# Altium project Draft1.PrjPcb
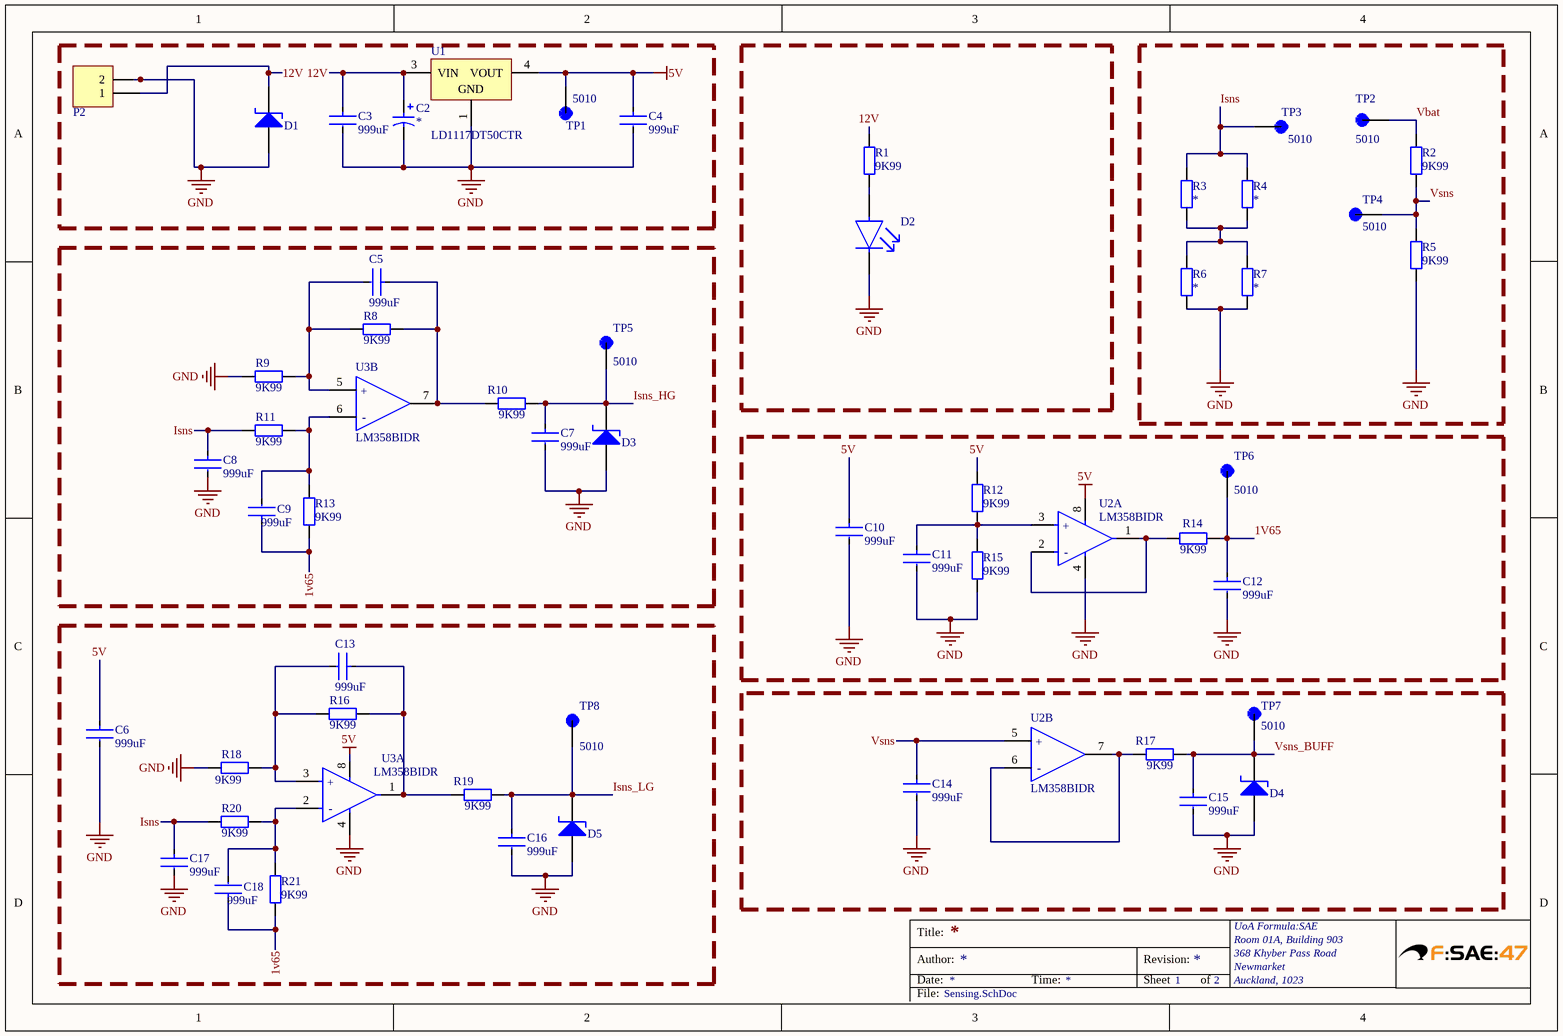
[diagram p0: Sensing.SchDoc]
2 sheets, 65 parts. Net scope: global (net labels, ports and power ports of the same name join across sheets).
Board file: Draft1.PcbDoc
Sheets:
  Sensing.SchDoc
  ESP32.SchDoc

## Sheet Sensing.SchDoc
size A4; Organization: UoA Formula:SAE; Address1: Room 01A, Building 903; Address2: 368 Khyber Pass Road; Address3: Newmarket; Address4: Auckland, 1023; SheetNumber: 1; SheetTotal: 2

### Parts
C2  *  [CAP-RAD-2.5mm Pitch]
C3  Capacitance: 999uF  [FP-CL21-IPC_A]  (hidden comment: CL21B104KBCNNNC)
C4  Capacitance: 999uF  [FP-CL21-IPC_A]  (hidden comment: CL21B104KBCNNNC)
C5  Capacitance: 999uF  [FP-CL21-IPC_A]  (hidden comment: CL21B104KBCNNNC)
C6  Capacitance: 999uF  [FP-CL21-IPC_A]  (hidden comment: CL21B104KBCNNNC)
C7  Capacitance: 999uF  [FP-CL21-IPC_A]  (hidden comment: CL21B104KBCNNNC)
C8  Capacitance: 999uF  [FP-CL21-IPC_A]  (hidden comment: CL21B104KBCNNNC)
C9  Capacitance: 999uF  [FP-CL21-IPC_A]  (hidden comment: CL21B104KBCNNNC)
C10  Capacitance: 999uF  [FP-CL21-IPC_A]  (hidden comment: CL21B104KBCNNNC)
C11  Capacitance: 999uF  [FP-CL21-IPC_A]  (hidden comment: CL21B104KBCNNNC)
C12  Capacitance: 999uF  [FP-CL21-IPC_A]  (hidden comment: CL21B104KBCNNNC)
C13  Capacitance: 999uF  [FP-CL21-IPC_A]  (hidden comment: CL21B104KBCNNNC)
C14  Capacitance: 999uF  [FP-CL21-IPC_A]  (hidden comment: CL21B104KBCNNNC)
C15  Capacitance: 999uF  [FP-CL21-IPC_A]  (hidden comment: CL21B104KBCNNNC)
C16  Capacitance: 999uF  [FP-CL21-IPC_A]  (hidden comment: CL21B104KBCNNNC)
C17  Capacitance: 999uF  [FP-CL21-IPC_A]  (hidden comment: CL21B104KBCNNNC)
C18  Capacitance: 999uF  [FP-CL21-IPC_A]  (hidden comment: CL21B104KBCNNNC)
D1  BZT52H-B4V7  [SOD123]  (value not drawn)
D2  LTST-C170GKT  [FP-LTST-C170GKT-MFG]  (value not drawn)
D3  BZT52H-B4V7  [SOD123]  (value not drawn)
D4  BZT52H-B4V7  [SOD123]  (value not drawn)
D5  BZT52H-B4V7  [SOD123]  (value not drawn)
P2  Connector2way  [ece-TER-2.02]  (value not drawn)
R1  Resistance: 9K99  [RESC2013X60X35ML10T20]  (hidden comment: RC0805FR-071KL)
R2  Resistance: 9K99  [RESC2013X60X35ML10T20]  (hidden comment: RC0805FR-071KL)
R3  D1MPAB2512QR002FA-T4  [2512 Res]  (value not drawn)
R4  D1MPAB2512QR002FA-T4  [2512 Res]  (value not drawn)
R5  Resistance: 9K99  [RESC2013X60X35ML10T20]  (hidden comment: RC0805FR-071KL)
R6  D1MPAB2512QR002FA-T4  [2512 Res]  (value not drawn)
R7  D1MPAB2512QR002FA-T4  [2512 Res]  (value not drawn)
R8  Resistance: 9K99  [RESC2013X60X35ML10T20]  (hidden comment: RC0805FR-071KL)
R9  Resistance: 9K99  [RESC2013X60X35ML10T20]  (hidden comment: RC0805FR-071KL)
R10  Resistance: 9K99  [RESC2013X60X35ML10T20]  (hidden comment: RC0805FR-071KL)
R11  Resistance: 9K99  [RESC2013X60X35ML10T20]  (hidden comment: RC0805FR-071KL)
R12  Resistance: 9K99  [RESC2013X60X35ML10T20]  (hidden comment: RC0805FR-071KL)
R13  Resistance: 9K99  [RESC2013X60X35ML10T20]  (hidden comment: RC0805FR-071KL)
R14  Resistance: 9K99  [RESC2013X60X35ML10T20]  (hidden comment: RC0805FR-071KL)
R15  Resistance: 9K99  [RESC2013X60X35ML10T20]  (hidden comment: RC0805FR-071KL)
R16  Resistance: 9K99  [RESC2013X60X35ML10T20]  (hidden comment: RC0805FR-071KL)
R17  Resistance: 9K99  [RESC2013X60X35ML10T20]  (hidden comment: RC0805FR-071KL)
R18  Resistance: 9K99  [RESC2013X60X35ML10T20]  (hidden comment: RC0805FR-071KL)
R19  Resistance: 9K99  [RESC2013X60X35ML10T20]  (hidden comment: RC0805FR-071KL)
R20  Resistance: 9K99  [RESC2013X60X35ML10T20]  (hidden comment: RC0805FR-071KL)
R21  Resistance: 9K99  [RESC2013X60X35ML10T20]  (hidden comment: RC0805FR-071KL)
TP1  5010  [TP_5010]
TP2  5010  [TP_5010]
TP3  5010  [TP_5010]
TP4  5010  [TP_5010]
TP5  5010  [TP_5010]
TP6  5010  [TP_5010]
TP7  5010  [TP_5010]
TP8  5010  [TP_5010]
U1  LD1117DT50CTR  [TO-252_M]
U2  LM358BIDR  [FP-D0008A-IPC_A]  (parts A,B of 2)
U3  LM358BIDR  [FP-D0008A-IPC_A]  (parts A,B of 2)

### Nets
5V: C4.1 C6.1 C10.1 R12.2 TP1.TP U1.4(VOUT) U2.8(V+) U3.8(V+)
GND: C2.2 C3.2 C4.2 C6.2 C7.2 C8.2 C10.2 C11.2 C12.2 C14.2 C15.2 C16.2 C17.2 D1.1(A) D2.1(C) D3.1(A) D4.1(A) D5.1(A) P2.2 R5.1 R6.1 R7.1 R9.1 R15.1 R18.1 U1.1(GND) U2.4(V-) U3.4(V-)
1V65: C9.1 C12.1 C18.1 R13.1 R14.2 R21.1 TP6.TP
12V: C2.1 C3.1 D1.2(K) P2.1 R1.2 U1.3(VIN)
Isns: C8.1 C17.1 R3.2 R4.2 R11.1 R20.1 TP3.TP
Isns_HG: C7.1 D3.2(K) R10.2 TP5.TP
Isns_LG: C16.1 D5.2(K) R19.2 TP8.TP
Vbat: R2.2 TP2.TP
Vsns: C14.1 R2.1 R5.2 TP4.TP U2.5(IN2+)
Vsns_BUFF: C15.1 D4.2(K) R17.2 TP7.TP
NetC5_1: C5.1 R8.2 R10.1 U3.7(OUT2)
NetC5_2: C5.2 R8.1 R9.2 U3.5(IN2+)
NetC9_2: C9.2 R11.2 R13.2 U3.6(IN2-)
NetC11_1: C11.1 R12.1 R15.2 U2.3(IN1+)
NetC13_1: C13.1 R16.2 R19.1 U3.1(OUT1)
NetC13_2: C13.2 R16.1 R18.2 U3.3(IN1+)
NetC18_2: C18.2 R20.2 R21.2 U3.2(IN1-)
NetD2_2: D2.2(A) R1.1
NetR3_1: R3.1 R4.1 R6.2 R7.2
NetR14_1: R14.1 U2.1(OUT1) U2.2(IN1-)
NetR17_1: R17.1 U2.6(IN2-) U2.7(OUT2)

### Notes on the sheet
- Title:
- Author:
- Date:
- Time:
- Revision:
- Sheet
- of
- File:
- (in symbol CMP-04895-000094-1, part A) +; -
- (in symbol CMP-04895-000094-1, part B) +; -

### Library data of the parts
C2 = ElecCap_TH_2P0: Electrolytic capacitor with radial package, 2mm pitch and 5.2mm diameter; Published: 8-Jun-2000; LatestRevisionDate: 17-Jul-2002; LatestRevisionNote: Re-released for DXP Platform.; PackageReference: POLAR0.8; Publisher: Altium Limited; PackageDescription: Polarized Capacitor; 2 Leads; Value: *
C3-C18 = 0805CAP: 0805 Cap General Purpose; Tolerance: 10%; Material: Ceramic; Voltage Rating (DC): 50V; Dielectric: X7R; Depth: 1.25mm; Height: 0.85mm; Width: 0.049inch; Case Code (Metric): 2012; Case Code (Imperial): 0805; Thickness: 0.037inch; Min Operating Temperature: -55°C; Contact Plating: Tin; Length: 2mm; Mount: Surface Mount; Lead Free: Lead Free; Radiation Hardening: No; Voltage Rating: 50V; Case/Package: 0805; Packaging: Tape and Reel; Max Operating Temperature: 125°C; Voltage: 50V
D1 D3-D5 = Zener_SMT_SOD123: SMT zener diode with SOD123 package; Manufacturer: Nexperia USA Inc.; Manufacturer Part Number: BZT52H-B4V7,115; Tolerance: ±2%; Supplier 1: Digi-Key; RoHS: RoHS Compliant; Category: Discrete Semiconductor Products; Stock 1: 0; Pricing 1: 1=0.51, 10=0.408, 100=0.2164, 500=0.14232, 1000=0.09678 (NZD); Packaging: Cut Tape (CT); Part Status: Active; Operating Temperature: -65°C ~ 150°C (TA); Mounting Type: Surface Mount; Package / Case: SOD-123F; Supplier Device Package: SOD-123F; ComponentLink1URL: https://assets.nexperia.com/documents/data-sheet/BZT52H_SER.pdf; ComponentLink1Description: https://assets.nexperia.com/documents/data-sheet/BZT52H_SER.pdf; Supplier Part Number 1: 1727-1611-1-ND
D2 = CMP-1674-00002-6: LED yellow green 0805 wavelength 569nm light intensity 6mcd Front Mounting; Manufacturer: Lite-On; Lens Style: Diffused; Forward Voltage: 2.1V; Number of Elements: 1; Wavelength: 565nm; Test Current: 10mA; Power Dissipation: 100mW; Reverse Voltage: 5V; Forward Current: 30mA; Lens Transparency: Clear; Viewing Angle: 130°; Lens Color: Colorless; Current: 4A; Shape: Rectangular; Min Operating Temperature: -55°C; Dominant Wavelength: 569nm; Number of Pins: 2; Max Operating Temperature: 85°C; Color: Green; Luminous Intensity: 6mcd; Radiation Hardening: No; Illumination Color: Green; Case Code (Metric): 2012; Case/Package: 0805; Width: 1.25mm; Case Code (Imperial): 0805; Package Quantity: 1; Height: 1.1mm; Depth: 1.25mm; Length: 2mm; Power Rating: 100mW; Lead Free: Lead Free; Number of LEDs: 1; Packaging: Tape and Reel; Mount: Surface Mount; Voltage: 5V; Supplier: Avnet; Supplier Part Number: LTST-C170GKT; Manufacturer Part Number: LTST-C170GKT; RoHS: Compliant; Category: LEDs; Stock: 408000; Pricing: 3000=0.03046, 6000=0.02977, 12000=0.02908, 24000=0.0284, 48000=0.02771 (USD); China RoHS: Compliant; Country of Origin: Mainland China; Export Control Classification Number (ECCN) Code: EAR99; Harmonized Tariff Schedule (HTS) Code: 8541.40.20.00; Introduction Date: 1997-12-01; Lifecycle Status: Production; Mounting Technology: Surface Mount; Number of Circuits: 1; Pins: 2; Number of Terminals: 2; Peak Wavelength: 565nm; REACH SVHC: Yes; Schedule B: 8541402000, 8541402000|8541402000|8541402000|8541402000|8541402000|8541402000|8541402000|8541402000|8541402000|8541402000|8541402000|8541402000|8541402000|8541402000|8541402000|8541402000|8541402000|8541402000|8541402000|8541402000|8541402000|8541402000|8541402000|85; Terminal Pitch: 2.1mm; ComponentLink1URL: https://datasheet.octopart.com:443/LTST-C170GKT-Lite-On-datasheet-180605137.pdf?src-supplier=IHS; ComponentLink1Description: https://datasheet.octopart.com:443/LTST-C170GKT-Lite-On-datasheet-180605137.pdf?src-supplier=IHS; ComponentLink2URL: https://datasheet.octopart.com:443/LTST-C170GKT-Lite-On-datasheet-141439001.pdf?src-supplier=Upverter; ComponentLink2Description: https://datasheet.octopart.com:443/LTST-C170GKT-Lite-On-datasheet-141439001.pdf?src-supplier=Upverter; ComponentLink3URL: https://datasheet.octopart.com:443/LTST-C170GKT-Lite-On-datasheet-159307.pdf?src-supplier=Arrow+Electronics; ComponentLink3Description: https://datasheet.octopart.com:443/LTST-C170GKT-Lite-On-datasheet-159307.pdf?src-supplier=Arrow+Electronics; ComponentLink4URL: https://datasheet.octopart.com:443/LTST-C170GKT-Lite-On-datasheet-8330158.pdf?src-supplier=TME; ComponentLink4Description: https://datasheet.octopart.com:443/LTST-C170GKT-Lite-On-datasheet-8330158.pdf?src-supplier=TME; ComponentLink5URL: https://datasheet.octopart.com:443/LTST-C170GKT-Lite-On-datasheet-26684672.pdf?src-supplier=Future+Electronics; ComponentLink5Description: https://datasheet.octopart.com:443/LTST-C170GKT-Lite-On-datasheet-26684672.pdf?src-supplier=Future+Electronics; ComponentLink6URL: https://datasheet.octopart.com:443/LTST-C170GKT-Lite-On-datasheet-59241.pdf?src-supplier=DigiKey; ComponentLink6Description: https://datasheet.octopart.com:443/LTST-C170GKT-Lite-On-datasheet-59241.pdf?src-supplier=DigiKey; ComponentLink7URL: https://datasheet.octopart.com:443/LTST-C170GKT-Lite-On-datasheet-14174986.pdf?src-supplier=iiiC; ComponentLink7Description: https://datasheet.octopart.com:443/LTST-C170GKT-Lite-On-datasheet-14174986.pdf?src-supplier=iiiC
P2 = Connector2way: 2 way screw connector
R1 R2 R5 R8-R21 = 0805RESISTOR: 0805 General Purpose  0.125W SMD; Manufacturer: Yageo; Temperature Coefficient: 100ppm/degreesC; Voltage Rating (DC): 150V; Max Power Dissipation: 125mW; Tolerance: 1%; Number of Pins: 2; Number of Terminations: 2; Datasheet URL: http://www.yageo.com/NewPortal/yageodocoutput?fileName=/pdf/R-Chip/PYu-RC_Group_51_RoHS_L_5.pdf; Length: 0.079inch; Package Description: 2-Pin Surface Mounted Device, Body 2 x 1.25 mm; Depth: 1.25mm; Height: 0.024inch; Military Standard: Not; Case/Package: 0805; Package Reference: 0805; RoHSCompliant: true; Lead Free: LeadFree; Packaging: TapeandReel; Package Quantity: 1; Datasheet Version: Rev. 5, 10/2016; Min Operating Temperature: -55degC; Voltage Rating: 150V; Composition: ThickFilm; Case Code (Imperial): 0805; Power Rating: 125mW; Width: 0.049inch; Case Code (Metric): 2012; Manufacturer URL: http://www.yageo.com/; Max Operating Temperature: 155degC; REACH SVHC: Unknown; Termination: SMD/SMT
R3 R4 R6 R7 = D1MPAB2512QR002FA-T4: Res 0.002 Ohm 1% 2W 2512; Manufacturer: Thin Film Tech; Supplier: DigiKey; Supplier Part Number: 4463-D1MPAB2512QR002FA-T4CT-ND; Manufacturer Part Number: D1MPAB2512QR002FA-T4; Category: Chip SMD Resistors; Stock: 90233; Pricing: 1=0.47, 10=0.299, 25=0.2532, 50=0.2248, 100=0.2006, 250=0.17396, 500=0.1573, 1000=0.14313 (USD); Value: *
TP1-TP8 = 5010: Test Point MultiPurpose THM .445 L .125 OD Heat Resistant Nylon 46 Red | Keystone Electronics 5010; SnapEDA_Link: https://www.snapeda.com/parts/5010/Keystone/view-part/?ref=snap; Package: NON STANDARD-1 Keystone; Value: *; MF: Keystone Electronics; MP: 5010; Check_prices: https://www.snapeda.com/parts/5010/Keystone/view-part/?ref=eda
U1 = CMP-0244-00109-1: Fixed Low Drop Positive Voltage Regulator, 5V, 3-Pin DPAK, Tape and Reel; ComponentLink2URL: http://www.st.com/internet/com/TECHNICAL_RESOURCES/TECHNICAL_LITERATURE/DATASHEET/CD00000544.pdf; ComponentLink1URL: http://www.st.com; PackageReference: TO-252; DatasheetVersion: 1/11/2011; ComponentLink1Description: Manufacturer URL; PackageVersion: 2011; ComponentLink2Description: Datasheet; PackageDescription: 3-Pin Transistor Outline Package 2.28 mm Pitch, 9.7 mm Lead Span (DPAK)
U2 U3 = CMP-04895-000094-1: IC OPAMP GP 2 CIRCUIT 8SOIC; RoHS Compliant: Yes

## Sheet ESP32.SchDoc
size A4; SheetNumber: 2; SheetTotal: 2
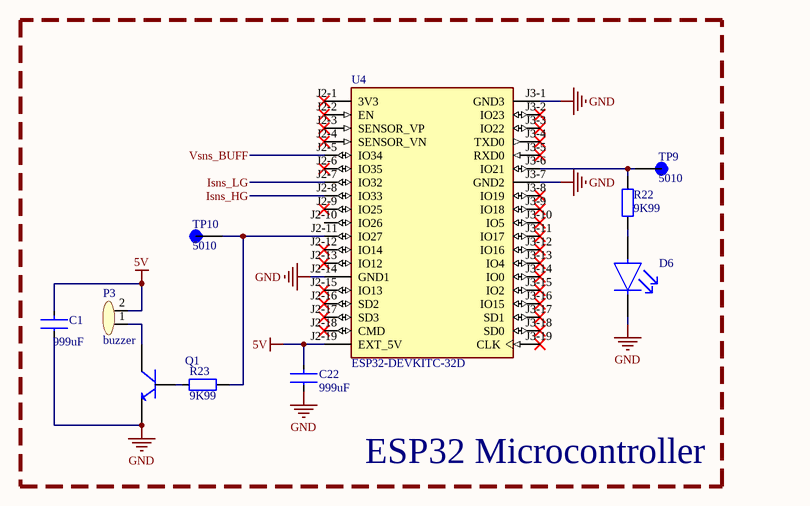
[diagram p1: ESP32.SchDoc]

### Parts
C1  Capacitance: 999uF  [FP-CL21-IPC_A]  (hidden comment: CL21B104KBCNNNC)
C22  Capacitance: 999uF  [FP-CL21-IPC_A]  (hidden comment: CL21B104KBCNNNC)
D6  LTST-C170GKT  [FP-LTST-C170GKT-MFG]  (value not drawn)
P3  buzzer  [ece-buzzer]
Q1  BC547/549  [ece-TO-92Z]  (value not drawn)
R22  Resistance: 9K99  [RESC2013X60X35ML10T20]  (hidden comment: RC0805FR-071KL)
R23  Resistance: 9K99  [RESC2013X60X35ML10T20]  (hidden comment: RC0805FR-071KL)
TP9  5010  [TP_5010]
TP10  5010  [TP_5010]
U4  ESP32-DEVKITC-32D  [MODULE_ESP32-DEVKITC-32D]

### Blocks framed on the sheet
ESP32 Microcontroller: C1 C22 D6 P3 Q1 R22 R23 TP9 TP10 U4

### Nets
5V: C1.1 C22.1 P3.2 U4.J2-19(EXT_5V)
GND: C1.2 C22.2 D6.1(C) Q1.3(E) U4.J2-14(GND1) U4.J3-1(GND3) U4.J3-7(GND2)
Isns_HG: U4.J2-8(IO33)
Isns_LG: U4.J2-7(IO32)
Vsns_BUFF: U4.J2-5(IO34)
NetD6_2: D6.2(A) R22.1
NetP3_1: P3.1 Q1.1(C)
NetQ1_2: Q1.2(B) R23.2
NetR22_2: R22.2 TP9.TP U4.J3-6(IO21)
NetR23_1: R23.1 TP10.TP U4.J2-11(IO27)

Not connected (* = marked no-connect by the designer): U4 J2-1(3V3)* J2-2(EN)* J2-3(SENSOR_VP)* J2-4(SENSOR_VN)* J2-6(IO35)* J2-9(IO25)* J2-10(IO26) J2-12(IO14)* J2-13(IO12)* J2-15(IO13)* J2-16(SD2)* J2-17(SD3)* J2-18(CMD)* J3-2(IO23)* J3-3(IO22)* J3-4(TXD0)* J3-5(RXD0)* J3-8(IO19)* J3-9(IO18)* J3-10(IO5)* J3-11(IO17)* J3-12(IO16)* J3-13(IO4)* J3-14(IO0)* J3-15(IO2)* J3-16(IO15)* J3-17(SD1)* J3-18(SD0)* J3-19(CLK)*

### Library data of the parts
C1 C22 = 0805CAP: as C3 on sheet Sensing; Depth: 1.25mm; Height: 0.85mm; Width: 0.049inch; Case Code (Metric): 2012; Case Code (Imperial): 0805; Thickness: 0.037inch; Min Operating Temperature: -55°C; Contact Plating: Tin; Length: 2mm; Mount: Surface Mount; Lead Free: Lead Free; Radiation Hardening: No; Voltage Rating: 50V; Case/Package: 0805; Packaging: Tape and Reel; Max Operating Temperature: 125°C; Voltage: 50V
D6 = CMP-1674-00002-6: as D2 on sheet Sensing; Min Operating Temperature: -55°C; Dominant Wavelength: 569nm; Number of Pins: 2; Max Operating Temperature: 85°C; Color: Green; Luminous Intensity: 6mcd; Radiation Hardening: No; Illumination Color: Green; Case Code (Metric): 2012; Case/Package: 0805; Width: 1.25mm; Case Code (Imperial): 0805; Package Quantity: 1; Height: 1.1mm; Depth: 1.25mm; Length: 2mm; Power Rating: 100mW; Lead Free: Lead Free; Number of LEDs: 1; Packaging: Tape and Reel; Mount: Surface Mount; Voltage: 5V; Supplier: Avnet; Supplier Part Number: LTST-C170GKT; Manufacturer Part Number: LTST-C170GKT; RoHS: Compliant; Category: LEDs; Stock: 408000; Pricing: 3000=0.03046, 6000=0.02977, 12000=0.02908, 24000=0.0284, 48000=0.02771 (USD); China RoHS: Compliant; Country of Origin: Mainland China; Export Control Classification Number (ECCN) Code: EAR99; Harmonized Tariff Schedule (HTS) Code: 8541.40.20.00; Introduction Date: 1997-12-01; Lifecycle Status: Production; Mounting Technology: Surface Mount; Number of Circuits: 1; Pins: 2; Number of Terminals: 2; Peak Wavelength: 565nm; REACH SVHC: Yes; Schedule B: 8541402000, 8541402000|8541402000|8541402000|8541402000|8541402000|8541402000|8541402000|8541402000|8541402000|8541402000|8541402000|8541402000|8541402000|8541402000|8541402000|8541402000|8541402000|8541402000|8541402000|8541402000|8541402000|8541402000|8541402000|85; Terminal Pitch: 2.1mm; ComponentLink1URL: https://datasheet.octopart.com:443/LTST-C170GKT-Lite-On-datasheet-180605137.pdf?src-supplier=IHS; ComponentLink1Description: https://datasheet.octopart.com:443/LTST-C170GKT-Lite-On-datasheet-180605137.pdf?src-supplier=IHS; ComponentLink2URL: https://datasheet.octopart.com:443/LTST-C170GKT-Lite-On-datasheet-141439001.pdf?src-supplier=Upverter; ComponentLink2Description: https://datasheet.octopart.com:443/LTST-C170GKT-Lite-On-datasheet-141439001.pdf?src-supplier=Upverter; ComponentLink3URL: https://datasheet.octopart.com:443/LTST-C170GKT-Lite-On-datasheet-159307.pdf?src-supplier=Arrow+Electronics; ComponentLink3Description: https://datasheet.octopart.com:443/LTST-C170GKT-Lite-On-datasheet-159307.pdf?src-supplier=Arrow+Electronics; ComponentLink4URL: https://datasheet.octopart.com:443/LTST-C170GKT-Lite-On-datasheet-8330158.pdf?src-supplier=TME; ComponentLink4Description: https://datasheet.octopart.com:443/LTST-C170GKT-Lite-On-datasheet-8330158.pdf?src-supplier=TME; ComponentLink5URL: https://datasheet.octopart.com:443/LTST-C170GKT-Lite-On-datasheet-26684672.pdf?src-supplier=Future+Electronics; ComponentLink5Description: https://datasheet.octopart.com:443/LTST-C170GKT-Lite-On-datasheet-26684672.pdf?src-supplier=Future+Electronics; ComponentLink6URL: https://datasheet.octopart.com:443/LTST-C170GKT-Lite-On-datasheet-59241.pdf?src-supplier=DigiKey; ComponentLink6Description: https://datasheet.octopart.com:443/LTST-C170GKT-Lite-On-datasheet-59241.pdf?src-supplier=DigiKey; ComponentLink7URL: https://datasheet.octopart.com:443/LTST-C170GKT-Lite-On-datasheet-14174986.pdf?src-supplier=iiiC; ComponentLink7Description: https://datasheet.octopart.com:443/LTST-C170GKT-Lite-On-datasheet-14174986.pdf?src-supplier=iiiC
Q1 = BC547/549: NPN Transistor; Value: BC547/549
R22 R23 = 0805RESISTOR: as R1 on sheet Sensing; Number of Pins: 2; Number of Terminations: 2; Datasheet URL: http://www.yageo.com/NewPortal/yageodocoutput?fileName=/pdf/R-Chip/PYu-RC_Group_51_RoHS_L_5.pdf; Length: 0.079inch; Package Description: 2-Pin Surface Mounted Device, Body 2 x 1.25 mm; Depth: 1.25mm; Height: 0.024inch; Military Standard: Not; Case/Package: 0805; Package Reference: 0805; RoHSCompliant: true; Lead Free: LeadFree; Packaging: TapeandReel; Package Quantity: 1; Datasheet Version: Rev. 5, 10/2016; Min Operating Temperature: -55degC; Voltage Rating: 150V; Composition: ThickFilm; Case Code (Imperial): 0805; Power Rating: 125mW; Width: 0.049inch; Case Code (Metric): 2012; Manufacturer URL: http://www.yageo.com/; Max Operating Temperature: 155degC; REACH SVHC: Unknown; Termination: SMD/SMT
TP9 TP10 = 5010: as TP1 on sheet Sensing; SnapEDA_Link: https://www.snapeda.com/parts/5010/Keystone/view-part/?ref=snap; Package: NON STANDARD-1 Keystone; Value: *; MF: Keystone Electronics; MP: 5010; Check_prices: https://www.snapeda.com/parts/5010/Keystone/view-part/?ref=eda
U4 = ESP32-DEVKITC-32D: WiFi Development Tools (802.11) ESP32 General Development Kit, ESP32-WROOM-32D on the board; MF: Espressif Systems; SnapEDA_Link: https://www.snapeda.com/parts/ESP32-DEVKITC-32D/Espressif+Systems/view-part/?ref=snap; Package: None; Value: *; MP: ESP32-DEVKITC-32D; Check_prices: https://www.snapeda.com/parts/ESP32-DEVKITC-32D/Espressif+Systems/view-part/?ref=eda

## Nets that join several sheets
5V: Sensing (8 pins), ESP32 (C1.1 C22.1 P3.2 U4.J2-19)
GND: Sensing (28 pins), ESP32 (7 pins)
Isns_HG: Sensing (C7.1 D3.2 R10.2 TP5.TP), ESP32 (U4.J2-8)
Isns_LG: Sensing (C16.1 D5.2 R19.2 TP8.TP), ESP32 (U4.J2-7)
Vsns_BUFF: Sensing (C15.1 D4.2 R17.2 TP7.TP), ESP32 (U4.J2-5)